# EAGLE design opto_endstop (EAGLE 6.2)
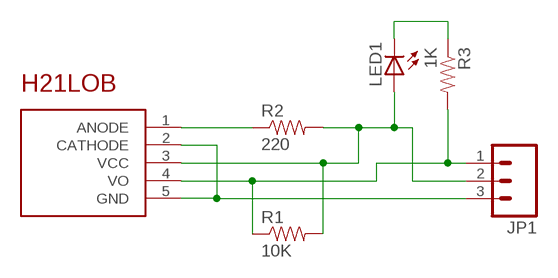
[diagram p0: schematic, sheet 1]

## Parts
JP1  M03LONGPADS  [1X03_LONGPADS]
LED1  LED5MM  [LED5MM]
R1  10K  RESISTORAXIAL-0.3-FRANK  [AXIAL-0.3]
R2  220  RESISTORAXIAL-0.3-FRANK  [AXIAL-0.3]
R3  1K  RESISTORAXIAL-0.3-FRANK  [AXIAL-0.3]
U$2  H21LOB  [H21]

## Nets
N$1: R2.P$1 U$2.1(ANODE)
N$2: JP1.2 LED1.A R1.P$2 R2.P$2 U$2.3(VCC)
N$3: JP1.3 U$2.2(CATHODE) U$2.5(GND)
N$4: JP1.1 R1.P$1 R3.P$2 U$2.4(VO)
N$5: LED1.K(C) R3.P$1

## Library data of the parts
JP1 = SparkFun-Connectors:M03: Header 3 Standard 3-pin 0.1" header. Use with straight break away headers (SKU : PRT-00116), right angle break away headers (PRT-00553), swiss pins (PRT-00743), machine pins (PRT-00117), and female headers (PRT-00115). Molex polarized connector foot print use with SKU : PRT-08232 with associated crimp pins and housings.
LED1 = SparkFun-LED:LED: LEDs Standard schematic elements and footprints for 5mm, 3mm, 1206, and 0603 sized LEDs. 5mm - Spark Fun Electronics SKU : COM-00529 (and others)
R1-R3 = SparkFun-Passives:RESISTOR: Resistor Basic schematic elements and footprints for 0603, 1206, and PTH resistors.
U$2 = reprap2:H21LOB

## Board
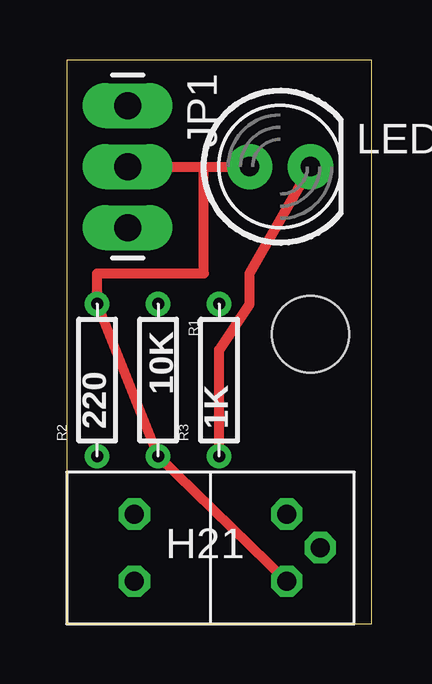
[diagram p1: board, top side]
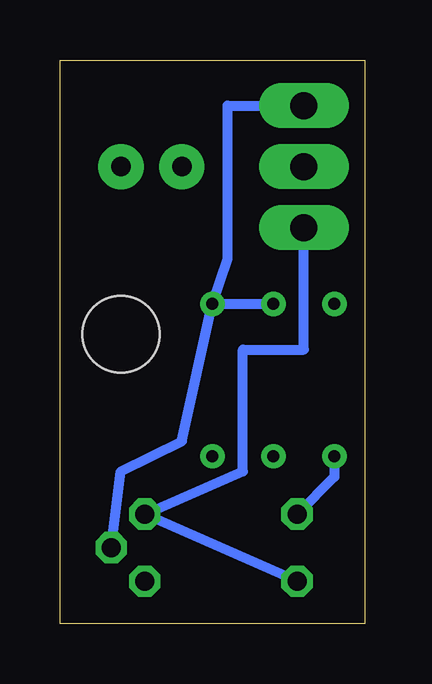
[diagram p2: board, bottom side, seen from below]

Size 12.7 x 23.5 mm. Coordinates in mm from the lower left corner, seen from the top.
Outline: 0,0 12.7,0 12.7,23.5 0,23.5 0,0
Copper layers (1*16): Top 0.035mm / dielectric 1.5mm / Bottom 0.035mm
Design rules: minimum track width 10mil, minimum drill 24mil, track to track 8mil, track to pad 8mil, pad to pad 8mil, via to via 8mil, smd to smd 8mil, copper to edge 40mil, drill to drill 8mil, minimum pad ring 10mil, minimum via ring 8mil, stop-mask expansion 4mil, vias tented up to drill 0mil, thermal gap 10mil
Holes 3.2 mm at 10.16,12.06

### Footprints (pad centres in the part's own frame; a part is rotated, then mirrored left to right if it is on the bottom)
1X03_LONGPADS = drill 1.118 pad 1.88 long: 1 0,0; 2 2.54,0; 3 5.08,0
LED5MM = drill 0.813 pad 1.88: A -1.27,0; K 1.27,0
AXIAL-0.3 = drill 0.5 pad 1.016: P$1 -3.81,0; P$2 2.54,0
H21 = drill 0.8 octagon: 1 2.819,4.572; 2 2.819,1.778; 3 9.169,1.778; 4 10.566,3.175; 5 9.169,4.572

### Placement (x,y rotation side)
JP1  2.54,21.59 270 top
LED1  8.89,19.05 0 top
R1  3.81,9.53 270 top
R2  1.27,10.79 90 top
R3  6.35,10.79 90 top
U$2  0,0 0 top

### Tracks (layer width: path | path; a pad name or v marks a point on that pad's centre or on a via)
N$1
  Bottom 0.406: R2.P$1 1.27,6.12 U$2.1
N$2
  Top 0.406: U$2.3 R1.P$2 R2.P$2 1.27,14.61 5.71,14.61 5.71,19.05 | JP1.2 5.71,19.05 | 5.71,19.05 LED1.A
N$3
  Bottom 0.406: U$2.2 U$2.5 5.08,6.35 5.08,11.43 2.54,11.43 JP1.3
N$4
  Bottom 0.406: U$2.4 10.16,6.35 7.62,7.62 R3.P$2 | R3.P$2 R1.P$1 | JP1.1 5.71,21.59 5.71,15.24 R3.P$2
N$5
  Top 0.406: R3.P$1 6.35,11.43 7.62,13.34 7.62,14.61 LED1.K